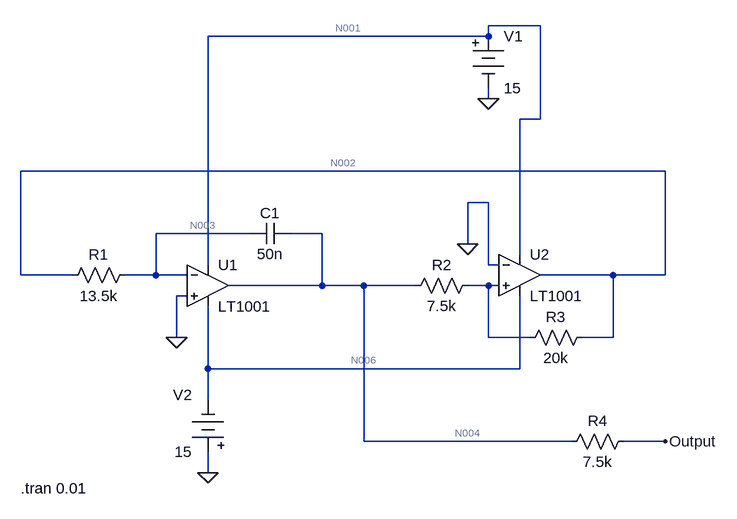
[diagram p0: schematic Triangular WaveForm Generator.asc]
Triangular WaveForm Generator.asc, the LTspice schematic file:
Version 4
SHEET 1 948 680
WIRE 592 -272 512 -272
WIRE 512 -256 512 -272
WIRE 512 -256 80 -256
WIRE 512 -160 512 -176
WIRE 592 -128 592 -272
WIRE 592 -128 560 -128
WIRE 784 -48 -208 -48
WIRE 512 0 480 0
WIRE 144 48 0 48
WIRE 256 48 208 48
WIRE 480 64 480 0
WIRE 560 80 560 -128
WIRE 80 96 80 -256
WIRE 512 96 512 0
WIRE 528 96 512 96
WIRE -208 112 -208 -48
WIRE -128 112 -208 112
WIRE 0 112 0 48
WIRE 0 112 -48 112
WIRE 48 112 0 112
WIRE 704 112 592 112
WIRE 784 112 784 -48
WIRE 784 112 704 112
WIRE 256 128 256 48
WIRE 256 128 112 128
WIRE 320 128 256 128
WIRE 400 128 320 128
WIRE 512 128 480 128
WIRE 528 128 512 128
WIRE 48 144 32 144
WIRE 32 208 32 144
WIRE 512 208 512 128
WIRE 576 208 512 208
WIRE 704 208 704 112
WIRE 704 208 656 208
WIRE 80 256 80 160
WIRE 560 256 560 144
WIRE 560 256 80 256
WIRE 80 304 80 256
WIRE 320 368 320 128
WIRE 640 368 320 368
WIRE 784 368 720 368
WIRE 80 416 80 384
FLAG 32 208 0
FLAG 512 -160 0
FLAG 480 64 0
FLAG 80 416 0
FLAG 784 368 Output
SYMBOL OpAmps\\LT1001 80 64 R0
SYMATTR InstName U1
SYMBOL res -32 96 R90
WINDOW 0 0 56 VBottom 2
WINDOW 3 32 56 VTop 2
SYMATTR InstName R1
SYMATTR Value 13.5k
SYMBOL cap 208 32 R90
WINDOW 0 0 32 VBottom 2
WINDOW 3 32 32 VTop 2
SYMATTR InstName C1
SYMATTR Value 50n
SYMBOL Misc\\battery 512 -272 R0
SYMATTR InstName V1
SYMATTR Value 15
SYMBOL OpAmps\\LT1001 560 48 R0
SYMATTR InstName U2
SYMBOL res 496 112 R90
WINDOW 0 0 56 VBottom 2
WINDOW 3 32 56 VTop 2
SYMATTR InstName R2
SYMATTR Value 7.5k
SYMBOL res 672 192 R90
WINDOW 0 0 56 VBottom 2
WINDOW 3 32 56 VTop 2
SYMATTR InstName R3
SYMATTR Value 20k
SYMBOL Misc\\battery 80 400 R180
WINDOW 0 24 104 Left 2
WINDOW 3 24 16 Left 2
SYMATTR InstName V2
SYMATTR Value 15
SYMBOL res 736 352 R90
WINDOW 0 0 56 VBottom 2
WINDOW 3 32 56 VTop 2
SYMATTR InstName R4
SYMATTR Value 7.5k
TEXT -208 440 Left 2 !.tran 0.01

The netlist it stands for:
* Triangular WaveForm Generator.asc
XU1 0 N003 N001 N006 N004 LT1001  ; pins In+ In- V+ V- OUT
R1 N003 N002 13.5k
C1 N004 N003 50n
V1 N001 0 15
XU2 N005 0 N001 N006 N002 LT1001  ; pins In+ In- V+ V- OUT
R2 N005 N004 7.5k
R3 N002 N005 20k
V2 0 N006 15
R4 Output N004 7.5k
.tran 0.01
.lib LTC.lib
.backanno
.end

* Results of the author's LTspice run, read from the files saved beside the schematic
* Operating Point, zero values left out:
*   V(n001) = 15 V
*   V(n006) = -15 V
*   I(V2) = -4.5 mA
*   I(V1) = -4.5 mA
*   Ix(u1:3) = 2.25 mA
*   Ix(u1:4) = -2.25 mA
*   Ix(u2:3) = 2.25 mA
*   Ix(u2:4) = -2.25 mA
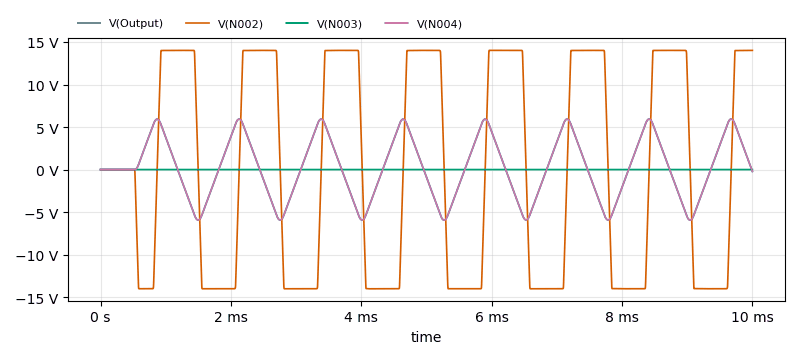
[diagram p1: Transient Analysis of Triangular WaveForm Generator.asc, plotted from the saved traces]
* Transient Analysis, 1 run:
*   V(Output): min -5.942 V, max 5.938 V, average 201.2 mV, rms 3.682 V, last -216.8 mV
*   V(N002): min -14.02 V, max 14.02 V, average 14.49 mV, rms 12.77 V, last 14.01 V
*   V(N003): min -3.903 mV, max 3.899 mV, average 4.836 µV, rms 3.551 mV, last 3.898 mV
*   V(N004): min -5.942 V, max 5.938 V, average 201.2 mV, rms 3.682 V, last -216.8 mV